# Altium schematic sheet Sheet1.SchDoc
size 381 x 177 mm; SheetNumber: 1; SheetTotal: 1
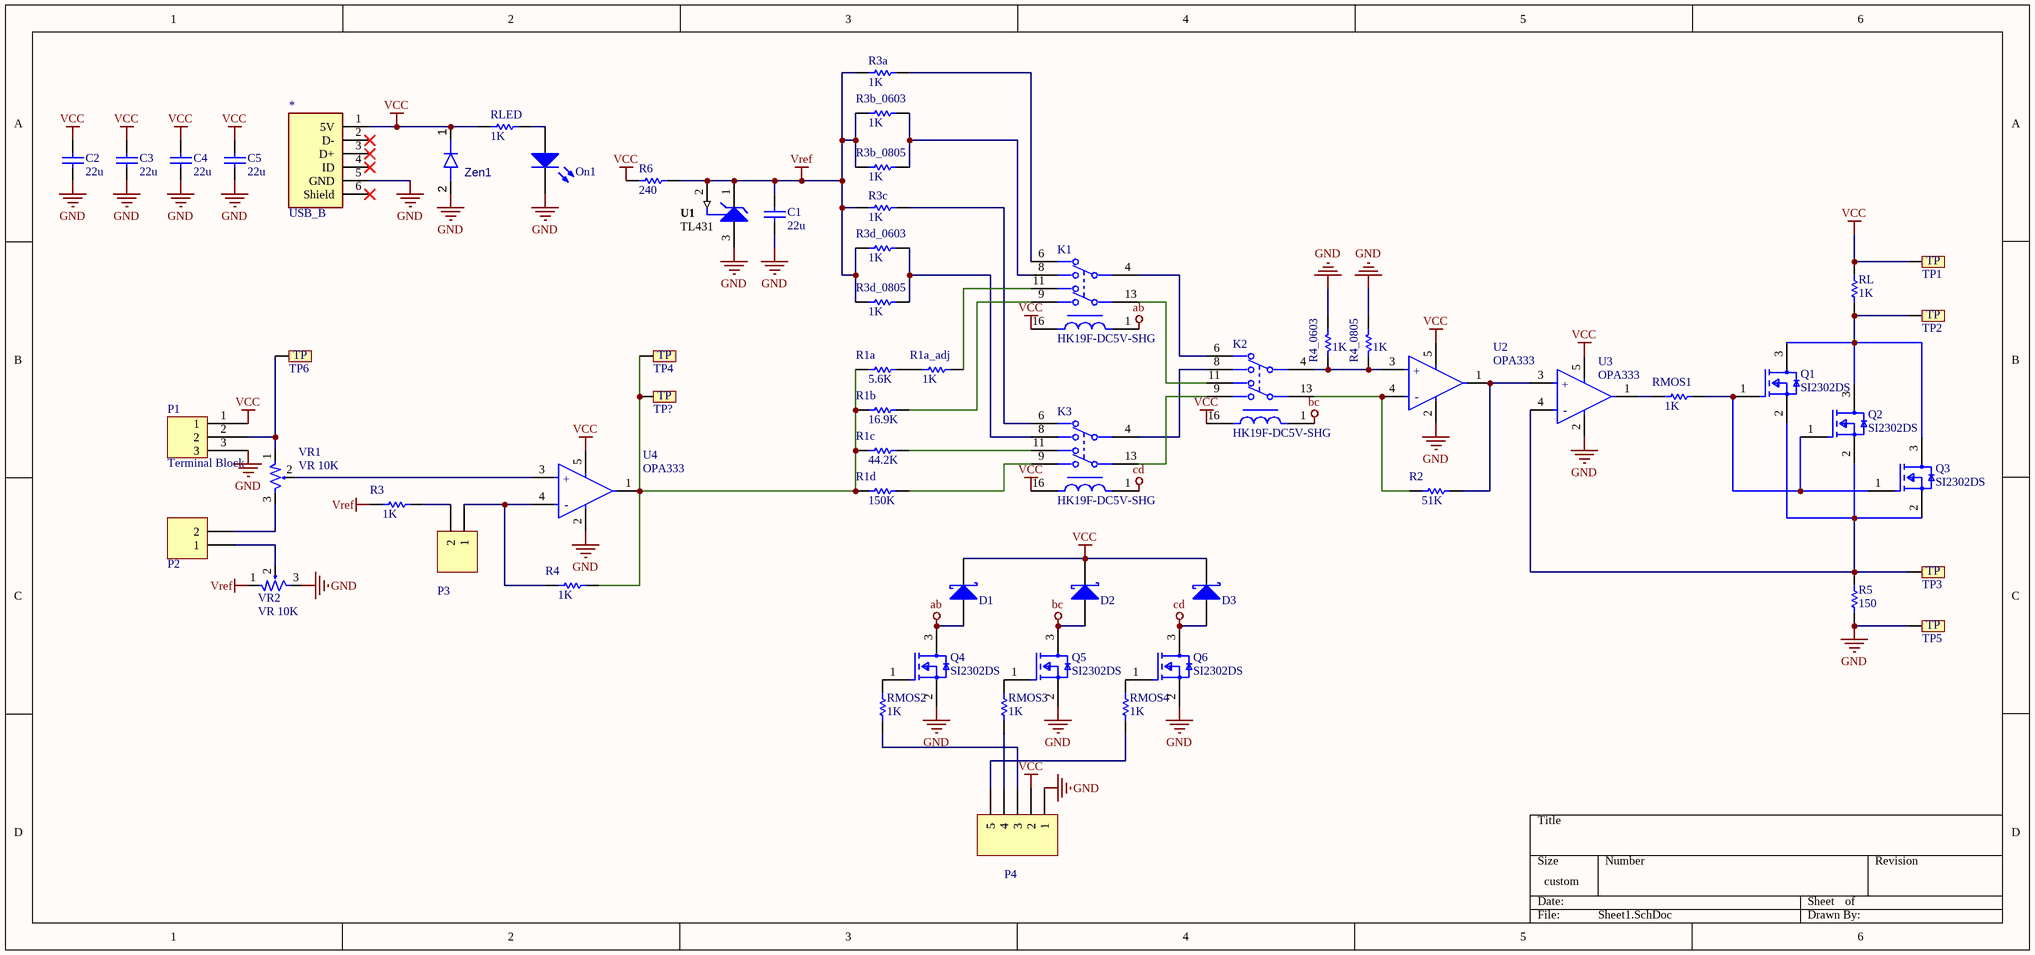
[diagram p0: Sheet1.SchDoc]

## Parts
*  USB_B  [USB_B]
C1  value 22u  [CAP-SM-0603]  (hidden comment: Cap Non-Pol SMD)
C2  value 22u  [CAP-SM-0603]  (hidden comment: Cap Non-Pol SMD)
C3  value 22u  [CAP-SM-0603]  (hidden comment: Cap Non-Pol SMD)
C4  value 22u  [CAP-SM-0603]  (hidden comment: Cap Non-Pol SMD)
C5  value 22u  [CAP-SM-0603]  (hidden comment: Cap Non-Pol SMD)
D1  D Schottky  [SS34]  (value not drawn)
D2  D Schottky  [SS34]  (value not drawn)
D3  D Schottky  [SS34]  (value not drawn)
K1  HK19F-DC5V-SHG  [FP-DS2Y-S-DC48V-MFG]
K2  HK19F-DC5V-SHG  [FP-DS2Y-S-DC48V-MFG]
K3  HK19F-DC5V-SHG  [FP-DS2Y-S-DC48V-MFG]
On1  LED SMD  [LED_0603_Blue]  (value not drawn)
P1  Terminal Block  [PCBComponent_1]
P2  Header 2  [JP2]  (value not drawn)
P3  Header 2  [JP2]  (value not drawn)
P4  Header 5  [JP5]  (value not drawn)
Q1  SI2302DS  [FP-S-03946-IPC_B]
Q2  SI2302DS  [FP-S-03946-IPC_B]
Q3  SI2302DS  [FP-S-03946-IPC_B]
Q4  SI2302DS  [FP-S-03946-IPC_B]
Q5  SI2302DS  [FP-S-03946-IPC_B]
Q6  SI2302DS  [FP-S-03946-IPC_B]
R1a  value 5.6K  [RES-SM-0603]  (hidden comment: RESISTOR SMD)
R1a_adj  value 1K  [RES-SM-0603]  (hidden comment: RESISTOR SMD)
R1b  value 16.9K  [RES-SM-0805]  (hidden comment: RESISTOR SMD)
R1c  value 44.2K  [RES-SM-0603]  (hidden comment: RESISTOR SMD)
R1d  value 150K  [RES-SM-0603]  (hidden comment: RESISTOR SMD)
R2  value 51K  [RES-SM-0603]  (hidden comment: RESISTOR SMD)
R3  value 1K  [RES-SM-0603]  (hidden comment: RESISTOR SMD)
R3a  value 1K  [RES-SM-0603]  (hidden comment: RESISTOR SMD)
R3b_0603  value 1K  [RES-SM-0603]  (hidden comment: RESISTOR SMD)
R3b_0805  value 1K  [RES-SM-0805]  (hidden comment: RESISTOR SMD)
R3c  value 1K  [RES-SM-0603]  (hidden comment: RESISTOR SMD)
R3d_0603  value 1K  [RES-SM-0603]  (hidden comment: RESISTOR SMD)
R3d_0805  value 1K  [RES-SM-0805]  (hidden comment: RESISTOR SMD)
R4  value 1K  [RES-SM-0603]  (hidden comment: RESISTOR SMD)
R4_0603  value 1K  [RES-SM-0603]  (hidden comment: RESISTOR SMD)
R4_0805  value 1K  [RES-SM-0805]  (hidden comment: RESISTOR SMD)
R5  value 150  [RES-SM-0603]  (hidden comment: RESISTOR SMD)
R6  value 240  [RES-SM-0805]  (hidden comment: RESISTOR SMD)
RL  value 1K  [RES 1/2W]  (hidden comment: RESISTOR)
RLED  value 1K  [RES-SM-0603]  (hidden comment: RESISTOR SMD)
RMOS1  value 1K  [RES-SM-0603]  (hidden comment: RESISTOR SMD)
RMOS2  value 1K  [RES-SM-0805]  (hidden comment: RESISTOR SMD)
RMOS3  value 1K  [RES-SM-0805]  (hidden comment: RESISTOR SMD)
RMOS4  value 1K  [RES-SM-0805]  (hidden comment: RESISTOR SMD)
TP1  Test Point  [TP]  (value not drawn)
TP2  Test Point  [TP]  (value not drawn)
TP3  Test Point  [TP]  (value not drawn)
TP4  Test Point  [TP]  (value not drawn)
TP5  Test Point  [TP]  (value not drawn)
TP6  Test Point  [TP]  (value not drawn)
TP?  Test Point  [TP]  (value not drawn)
U1  TL431  [DBZ0003A_M]
U2  OPA333  [FP-DBV0005A-MFG]
U3  OPA333  [FP-DBV0005A-MFG]
U4  OPA333  [FP-DBV0005A-MFG]
VR1  value VR 10K  [VARISTOR 2]  (hidden comment: 10K)
VR2  value VR 10K  [VARISTOR 2]  (hidden comment: 10K)
Zen1  MMSZ4689T1G  [ONSC-SOD-123-2-425-04_V]  (value not drawn)

## Nets
ab: D1.1(A) K1.1(+) Q4.3(D)
bc: D2.1(A) K2.1(+) Q5.3(D)
cd: D3.1(A) K3.1(+) Q6.3(D)
GND: *.5(GND) C1.1 C2.1 C3.1 C4.1 C5.1 On1.2(K) P1.3 P4.1 Q4.2(S) Q5.2(S) Q6.2(S) R4_0603.1 R4_0805.1 R5.1 TP5.TP1 U1.3(ANODE) U2.2(V-) U3.2(V-) U4.2(V-) VR2.3 Zen1.2(A)
VCC: *.1(5V) C2.2 C3.2 C4.2 C5.2 D1.2(K) D2.2(K) D3.2(K) K1.16(-) K2.16(-) K3.16(-) P1.1 P4.2 R6.1 RL.2 RLED.1 TP1.TP1 U2.5(V+) U3.5(V+) U4.5(V+) Zen1.1(K)
Vref: C1.2 R3.1 R3a.1 R3b_0603.1 R3b_0805.1 R3c.1 R3d_0603.1 R3d_0805.1 R6.2 U1.1(CATHODE) U1.2(REF) VR2.1
NetK1_4: K1.4(1_COM) K2.6(1_N.C.)
NetK1_6: K1.6(1_N.C.) R3a.2
NetK1_8: K1.8(1_N.O.) R3b_0603.2 R3b_0805.2
NetK1_9: K1.9(2_N.O.) R1b.2
NetK1_11: K1.11(2_N.C.) R1a_adj.2
NetK1_13: K1.13(2_COM) K2.11(2_N.C.)
NetK2_4: K2.4(1_COM) R4_0603.2 R4_0805.2 U2.3(+IN)
NetK2_8: K2.8(1_N.O.) K3.4(1_COM)
NetK2_9: K2.9(2_N.O.) K3.13(2_COM)
NetK2_13: K2.13(2_COM) R2.1 U2.4(-IN)
NetK3_6: K3.6(1_N.C.) R3c.2
NetK3_8: K3.8(1_N.O.) R3d_0603.2 R3d_0805.2
NetK3_9: K3.9(2_N.O.) R1d.2
NetK3_11: K3.11(2_N.C.) R1c.2
NetOn1_1: On1.1(A) RLED.2
NetP1_2: P1.2 TP6.TP1 VR1.1
NetP2_1: P2.1 VR2.2
NetP2_2: P2.2 VR1.3
NetP3_1: P3.1 R4.1 U4.4(-IN)
NetP3_2: P3.2 R3.2
NetP4_3: P4.3 RMOS2.1
NetP4_4: P4.4 RMOS3.1
NetP4_5: P4.5 RMOS4.1
NetQ1_1: Q1.1(G) Q2.1(G) Q3.1(G) RMOS1.2
NetQ1_2: Q1.2(S) Q2.2(S) Q3.2(S) R5.2 TP3.TP1 U3.4(-IN)
NetQ1_3: Q1.3(D) Q2.3(D) Q3.3(D) RL.1 TP2.TP1
NetQ4_1: Q4.1(G) RMOS2.2
NetQ5_1: Q5.1(G) RMOS3.2
NetQ6_1: Q6.1(G) RMOS4.2
NetR1a_1: R1a.1 R1b.1 R1c.1 R1d.1 R4.2 TP4.TP1 TP?.TP1 U4.1(OUT)
NetR1a_2: R1a.2 R1a_adj.1
NetR2_2: R2.2 U2.1(OUT) U3.3(+IN)
NetRMOS1_1: RMOS1.1 U3.1(OUT)
NetU4_3: U4.3(+IN) VR1.2

Not connected (* = marked no-connect by the designer): * 2(D-)* 3(D+)* 4(ID)* 6(Shield)*

## Notes on the sheet
- (in symbol CMP-0272-00862-4) +; -
- (in symbol Test Point) TP

## Library data of the parts
C1-C5 = Cap Non-Pol SMD: Capacitor
D1-D3 = D Schottky: Schottky Diode; Published: 8-Jun-2000; LatestRevisionDate: 17-Jul-2002; LatestRevisionNote: Re-released for DXP Platform.; PackageReference: SMB; Publisher: Altium Limited; PackageDescription: DO-214-AA/SMB; 2 C-Bend Leads; Body 5.3 x 3.6 mm, inc. leads (LxW); Code_JEDEC: DO-214-AA
K1-K3 = CMP-05607-000125-1: RELAY GEN PURPOSE DPDT 2A 48VDC; Voltage Rating (AC): 250V; Max Voltage Rating (DC): 220V; Relay Type: General Purpose; Coil Current: 6.3mA; Coil Resistance: 7.68kR; Release Time: 3ms; Coil Type: Non-Latching; Power Consumption: 200mW; Rise Time: 4ms; Coil Power: 300mW; Coil Voltage (DC): 48V; Depth: 9.9mm; Contact Plating: Gold; Mount: Through Hole; Radiation Hardening: No; Termination: PC Pin; Min Operating Temperature: -40°C; Length: 20mm; RoHS Compliant: No; Width: 9.9mm; Max Operating Temperature: 70°C; Lead Free: Lead Free; Relay Function: DPDT; Throw Configuration: DPDT; Series: DS2Y; Contact Current Rating: 2A; Max Voltage Rating (AC): 250V; Contact Material: Gold; Number of Pins: 8; Height: 9.3mm; Package Quantity: 50; Case/Package: DIP; Weight: 4g; Packaging: Rail/Tube; Voltage Rating (DC): 220V; Max Current Rating: 2A; Operate Time: 4ms
On1 = LED SMD: LED
P1 = Terminal Block: KF141-2.54-3-R
P2 P3 = Header 2: Header, 2-Pin; LatestRevisionDate: 17-Jul-2002; LatestRevisionNote: Re-released for DXP Platform.; Publisher: Altium Limited
P4 = Header 5: Header, 5-Pin; LatestRevisionDate: 17-Jul-2002; LatestRevisionNote: Re-released for DXP Platform.; Publisher: Altium Limited
Q1-Q6 = CMP-02550-000243-1: MOSFET N-CH 20V 2.9A SOT23-3; Max Power Dissipation: 710mW; Number of Channels: 1; Turn-On Delay Time: 8ns; Rise Time: 7ns; Continuous Drain Current (ID): 2.6A; Drain to Source Resistance: 57mR; Gate to Source Voltage (Vgs): 8V; Turn-Off Delay Time: 30ns; RoHS Compliant: Yes; Drain to Source Voltage (Vdss): 20V; Case/Package: SOT-23; Lead Free: Lead Free; Weight: 0.050717oz; REACH SVHC: No SVHC; Max Operating Temperature: 150°C; Number of Elements: 1; Fall Time: 7ns; Packaging: Tape and Reel; Package Quantity: 3000; Number of Pins: 3; Power Dissipation: 710mW; Mount: Surface Mount; Min Operating Temperature: -55°C
R1a R1a_adj R1b R1c R1d R2 R3 R3a R3b_0603 R3b_0805 R3c R3d_0603 R3d_0805 R4 R4_0603 R4_0805 R5 R6 RLED RMOS1-RMOS4 = RESISTOR SMD: Resistor
U1 = CMP-0366-01210-2: Adjustable Precision Shunt Regulator, 34 ppm / degC, 100 mA, -40 to 125 degC, 3-pin SOT-23 (DBZ), Green (RoHS & no Sb/Br); Manufacturer: Texas Instruments; PartNumber: TL431AQDBZR; Iout/Iz(Max)(mA): 100; Min Iz for Regulation(uA): 600; SubFamily: Shunt Voltage Reference; Temp Coeff(Typ)(ppm/ degree C): 34; VO Adj(Max)(V): 36; Rating: Catalog; Initial Accuracy @ 25/deg C(%): 1; VO Adj(Min)(V): 2.495; Temp Coeff(Max)(ppm/ degree C): 92; PackageReference: DBZ0003A; ComponentLink1Description: Manufacturer URL; Mounting Technology: Surface Mount; ComponentLink2URL: http://www.ti.com/general/docs/lit/getliterature.tsp?genericPartNumber=TL431A&fileType=pdf; PackageVersion: 4203227/B; ComponentLink2Description: Datasheet; PackageDescription: 3-Pin Plastic Small Outline, Body 2.92 x 1.3 mm, Pitch 0.95 mm; ComponentLink1URL: http://www.ti.com/; Eco-Plan: Green (RoHS & no Sb/Br); Code_JEDEC: TO-236; ComponentLink3URL: http://www.ti.com/litv/pdf/mpds108a; DatasheetVersion: SLVS543M; ComponentLink3Description: Package Specification
U2-U4 = CMP-0272-00862-4: IC OPAMP ZER-DRIFT 1CIRC SOT23-5; Number of Elements: 1; Common Mode Rejection Ratio: 106dB; Max Supply Voltage: 5.5V; Min Supply Voltage: 1.8V; Max I/O Voltage: 10uV; Output Current per Channel: 5mA; Max Dual Supply Voltage: 2.75V; Operating Supply Current: 17uA; Nominal Supply Current: 25uA; Bandwidth: 350kHz; Min Dual Supply Voltage: 900mV; Power Supply Rejection Ratio (PSRR): 120dB; Voltage Gain: 130dB; Input Bias Current: 200pA; Slew Rate: 0.16V/µs; Number of Channels: 1; Max Operating Temperature: 125°C; REACH SVHC: No SVHC; Number of Amplifiers: 1; Input Offset Voltage (Vos): 10uV; Radiation Hardening: No; Lead Free: Lead Free; Operating Supply Voltage: 2.75V; Min Operating Temperature: -40°C; Contact Plating: Gold; Number of Pins: 5; Output Current: 5mA; Packaging: Tape and Reel; Unity Gain Bandwidth Product: 350kHz; Number of Circuits: 1; Gain Bandwidth Product: 350kHz; Case/Package: SOT-23-5; Package Quantity: 1
VR1 VR2 = Var Resistor
Zen1 = CMP-004-00031-1: Zener Diode, 5.1V V(Z), 5%, 0.5W, Silicon, Unidirectional; Pins: 2; Min Operating Temperature: -55°C; RoHS Compliant: Yes; Max Operating Temperature: 150°C